# EAGLE design pwr (EAGLE 7.3.0)
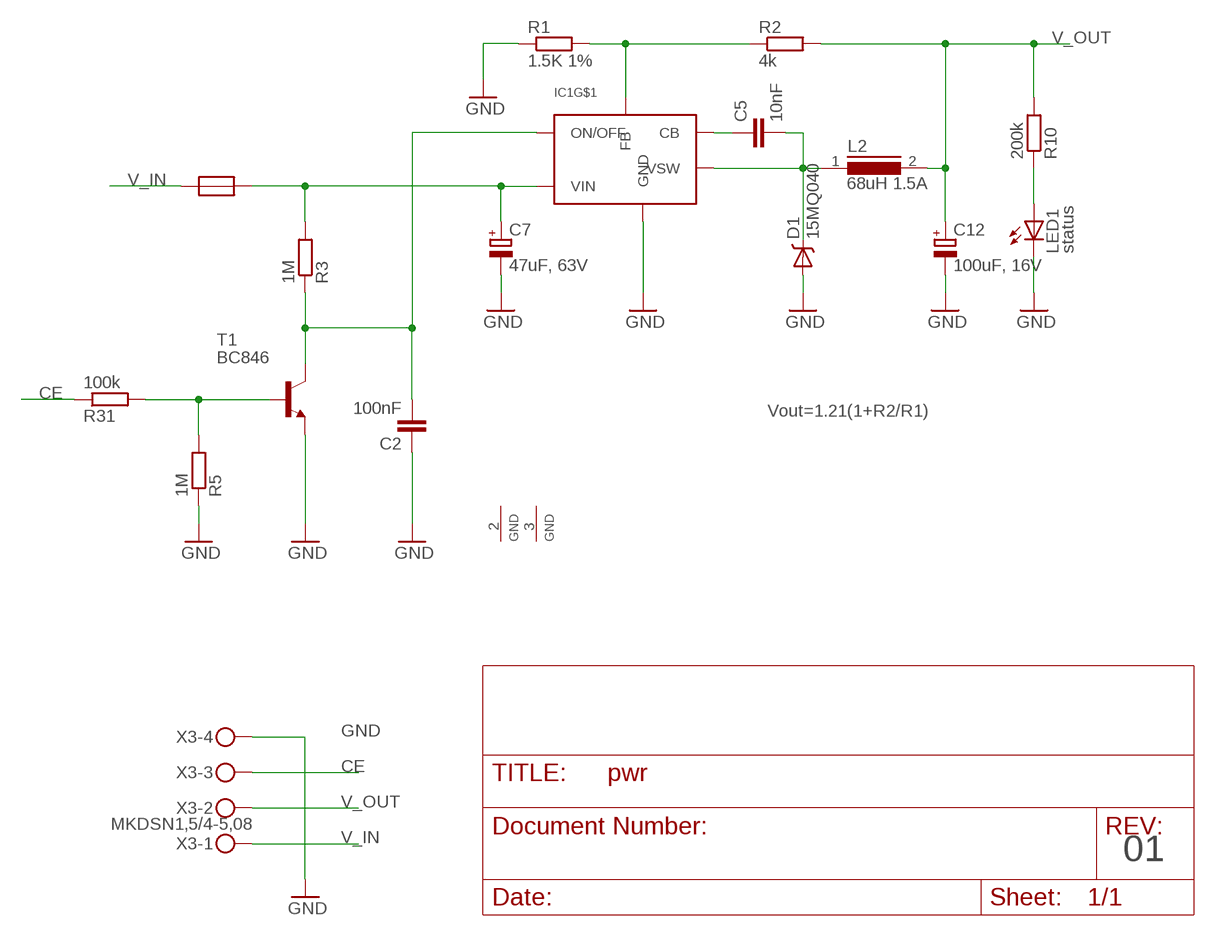
[diagram p0: schematic, sheet 1]

## Parts
C2  100nF  C-EUC0805  [C0805]
C5  10nF  C-EUC0805  [C0805]
C7  47uF, 63V  CPOL-EUF  [PANASONIC_F]
C12  100uF, 16V  CPOL-EUD  [PANASONIC_D]
D1  15MQ040  DIODE-SCHOTTKY-MBRA140  [SMA-DIODE]
IC1  LM2674  [SO-08]
L2  68uH 1.5A  DR125  [DR125]
LED1  status  LEDCHIP-LED0805  [CHIP-LED0805]
R1  1.5K 1%  R-EU_R0805W  [R0805W]
R2  4k  R-EU_R0805W  [R0805W]
R3  1M  R-EU_R0805W  [R0805W]
R5  1M  R-EU_R0805W  [R0805W]
R10  200k  R-EU_R0805W  [R0805W]
R31  100k  R-EU_R0805W  [R0805W]
T1  BC846  [SOT23]
U$1  RESETTABLE_0805  [0805W]
X3  MKDSN1,5/4-5,08  [MKDSN1,5/4-5,08]

## Nets
CE: R31.1 X3.3
GND: C2.1 C7.- C12.- D1.A IC1.6(GND) LED1.C R1.1 R5.1 T1.2(E) X3.4
N$1: LED1.A R10.1
N$2: C2.2 IC1.5(ON/OFF) R3.1 T1.3(C)
N$3: R5.2 R31.2 T1.1(B)
N$4: IC1.4(FB) R1.2 R2.1
N$9: C5.2 D1.C IC1.8(VSW) L2.1
N$10: C5.1 IC1.1(CB)
N$49: C7.+ IC1.7(VIN) R3.2 U$1.2
V_IN: U$1.1 X3.1
V_OUT: C12.+ L2.2 R2.2 R10.2 X3.2

## Notes on the sheet
- Vout=1.21(1+R2/R1)
- 01

## Power pins joined to a net without a drawn wire
GND: IC1.2(GND) IC1.3(GND)

## Library data of the parts
C2 C5 = rcl:C-EU: CAPACITOR, European symbol
C7 C12 = rcl:CPOL-EU: POLARIZED CAPACITOR, European symbol
D1 = SparkFun-DiscreteSemi:DIODE-SCHOTTKY: Schottky diodes in SFE's production catalog BAT20J 1A 23V 0.62Vf RB751 120mA 40V 0.37Vf PMEG4005EJ 0.5A 40V 0.42Vf MBRA140 1A 40V 0.5Vf B340A 3A 40V SMA; PROD_ID: DIO-08053; VALUE: MBRA140
IC1 = Simplex-ICs:LM2674: LM2674 power converter
L2 = inductors:DR125: High Power Density, High Efficiency, Shielded Inductors Source: coiltronics_dr_series.pdf
LED1 = led:LED: LED OSRAM: - CHIPLED LG R971, LG N971, LY N971, LG Q971, LY Q971, LO R971, LY R971 LH N974, LH R974 LS Q976, LO Q976, LY Q976 LO Q996 - Hyper CHIPLED LW Q18S LB Q993, LB Q99A, LB R99A - SideLED LS A670, LO A670, LY A670, LG A670, LP A670 LB A673, LV A673, LT A673, LW A673 LH A674 LY A675 LS A676, LA A676, LO A676, LY A676, LW A676 LS A679, LY A679, LG A679 - Hyper Micro SIDELED® LS Y876, LA Y876, LO Y876, LY Y876 LT Y87S - SmartLED LW L88C, LW L88S LB L89C, LB L89S, LG L890 LS L89K, LO L89K, LY L89K LS L896, LA L896, LO L896, LY L896 - TOPLED LS T670, LO T670, LY T670, LG T670, LP T670 LSG T670, LSP T670, LSY T670, LOP T670, LYG T670 LG T671, LOG T671, LSG T671 LB T673, LV T673, LT T673, LW T673 LH T674 LS T676, LA T676, LO T676, LY T676, LB T676, LH T676, LSB T676, LW T676 LB T67C, LV T67C, LT T67C, LS T67K, LO T67K, LY T67K, LW E67C LS E67B, LA E67B, LO E67B, LY E67B, LB E67C, LV E67C, LT E67C LW T67C LS T679, LY T679, LG T679 LS T770, LO T770, LY T770, LG T770, LP T770 LB T773, LV T773, LT T773, LW T773 LH T774 LS E675, LA E675, LY E675, LS T675 LS T776, LA T776, LO T776, LY T776, LB T776 LHGB T686 LT T68C, LB T68C - Hyper Mini TOPLED® LB M676 - Mini TOPLED Santana® LG M470 LS M47K, LO M47K, LY M47K Source: http://www.osram.convergy.de LUXEON: - LUMILED® LXK2-PW12-R00, LXK2-PW12-S00, LXK2-PW14-U00, LXK2-PW14-V00 LXK2-PM12-R00, LXK2-PM12-S00, LXK2-PM14-U00 LXK2-PE12-Q00, LXK2-PE12-R00, LXK2-PE12-S00, LXK2-PE14-T00, LXK2-PE14-U00 LXK2-PB12-K00, LXK2-PB12-L00, LXK2-PB12-M00, LXK2-PB14-N00, LXK2-PB14-P00, LXK2-PB14-Q00 LXK2-PR12-L00, LXK2-PR12-M00, LXK2-PR14-Q00, LXK2-PR14-R00 LXK2-PD12-Q00, LXK2-PD12-R00, LXK2-PD12-S00 LXK2-PH12-R00, LXK2-PH12-S00 LXK2-PL12-P00, LXK2-PL12-Q00, LXK2-PL12-R00 Source: www.luxeon.com KINGBRIGHT: KA-3528ASYC Source: www.kingbright.com
R1-R3 R5 R10 R31 = rcl:R-EU_: RESISTOR, European symbol
T1 = transistor:BC846: NPN TRANSISTOR
U$1 = Simplex-Fuses:RESETTABLE: resettable fuse
X3 = con-phoenix-508:MKDSN1,5/4-5,08: MKDSN 1,5/ 4-5,08 Printklemme Nennstrom: 13,5 A Nennspannung: 250 V Rastermaß: 5,08 mm Polzahl: 4 Anschlussart: Schraubanschluss Montage: Löten Anschlussrichtung Leiter/Platine: 0 ° Artikelnummer: 1729144 Source: http://eshop.phoenixcontact.com .. 1729144.pdf; MPN: SMKDSN1,5/4-5,08; OC_FARNELL: 1792905; OC_NEWARK: 70R0300

## Net classes
1 vcc: width 0.203 mm

## Board
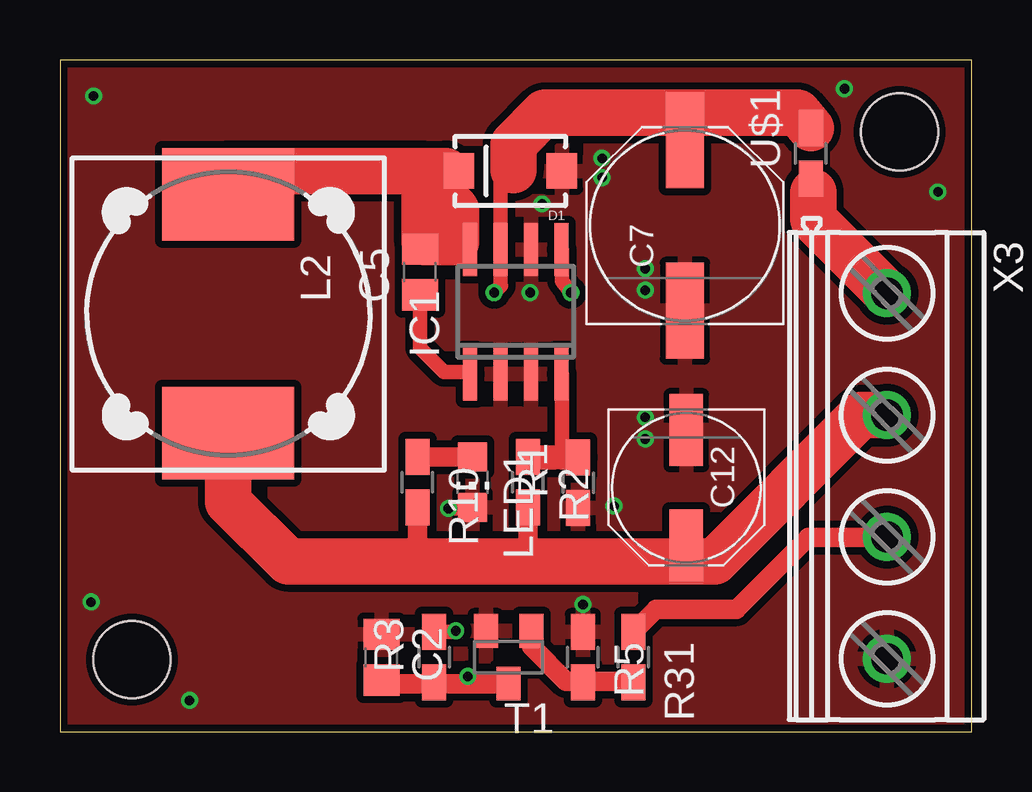
[diagram p1: board, top side]
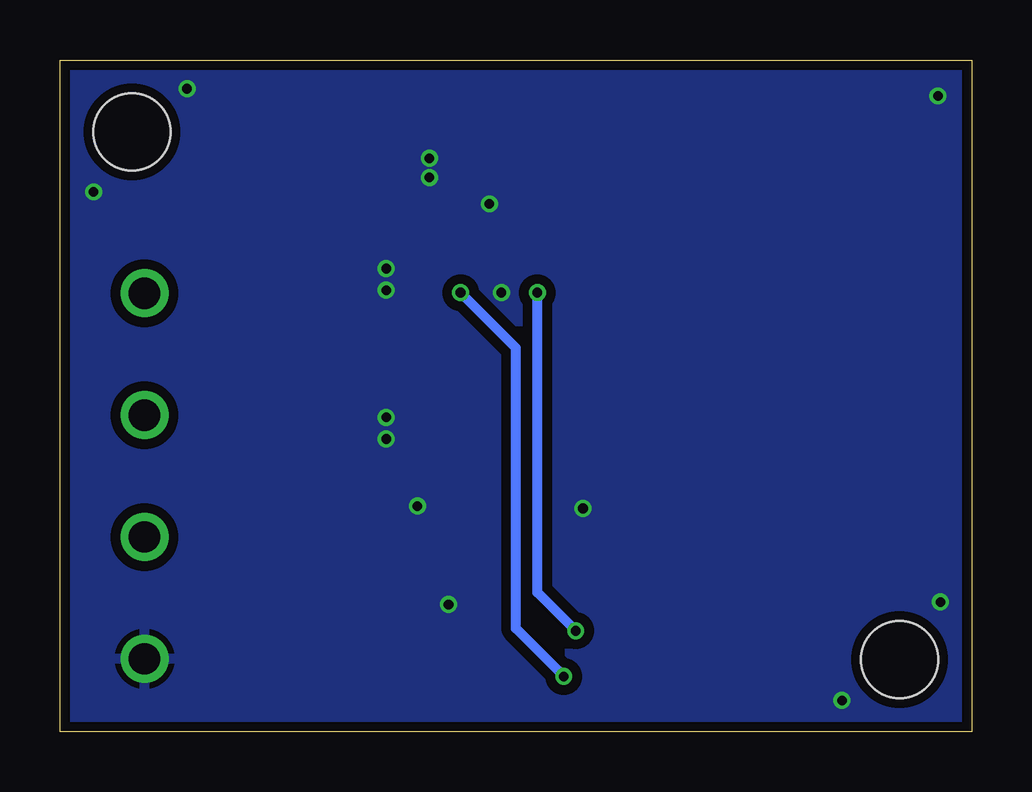
[diagram p2: board, bottom side, seen from below]

Size 38 x 28 mm. Coordinates in mm from the lower left corner, seen from the top.
Outline: 0,0 38,0 38,28 0,28 0,0
Copper layers (1*16): Top 0.035mm / dielectric 1.5mm / Bottom 0.035mm
Design rules "seeed_2-layer_20140221": minimum track width 6mil, minimum drill 12mil, track to track 6mil, track to pad 6mil, pad to pad 6mil, via to via 6mil, smd to smd 0mil, copper to edge 10mil, drill to drill 10mil, minimum pad ring 6mil, minimum via ring 6mil, stop-mask expansion 2mil, vias tented up to drill 100mil, thermal gap 10mil
Holes 3.2 mm at 35,25 3,3

### Footprints (pad centres in the part's own frame; a part is rotated, then mirrored left to right if it is on the bottom)
C0805 = smd 1.3 x 1.5: 1 -0.95,0; 2 0.95,0
PANASONIC_F = smd 4 x 1.6: + 3.55,0; - -3.55,0
PANASONIC_D = smd 3 x 1.4: + 2.4,0; - -2.4,0
SMA-DIODE = smd 1.27 x 1.47: A -2.15,0; C 2.15,0
SO-08 = smd 0.6 x 2.2: 1 -1.905,-2.6; 2 -0.635,-2.6; 3 0.635,-2.6; 4 1.905,-2.6; 5 1.905,2.6; 6 0.635,2.6; 7 -0.635,2.6; 8 -1.905,2.6
DR125 = smd 3.85 x 5.5: 1 -4.975,0; 2 4.975,0
CHIP-LED0805 = smd 1.2 x 1.2: A 0,-1.05; C 0,1.05
R0805W = smd 1.5 x 1: 1 -1.052,0; 2 1.052,0
SOT23 = smd 1 x 1.4: 1 -0.95,-1.1; 2 0.95,-1.1; 3 0,1.1
0805W = smd 1.5 x 1: 1 -1.052,0; 2 1.052,0
MKDSN1,5/4-5,08 = drill 1.3 pad 2: 1 -7.641,0.025; 2 -2.561,0.025; 3 2.519,0.025; 4 7.599,0.025

### Placement (x,y rotation side)
C2  13.4,3.1 270 top
C5  15,19.16 90 top
C7  26.05,21.1 90 top
C12  26.11,10.17 270 top
D1  18.77,23.37 180 top
IC1  19,17.5 0 top
L2  7.02,17.42 270 top
LED1  17.2,10.4 180 top
R1  21.6,10.38 90 top
R2  19.5,10.4 270 top
R3  15.6,3.1 90 top
R5  21.8,3.1 270 top
R10  14.9,10.4 270 top
R31  23.9,3.1 270 top
T1  18.7,3.1 180 top
U$1  31.3,24.1 90 top
X3  34.45,10.63 270 top

### Tracks (layer width: path | path; a pad name or v marks a point on that pad's centre or on a via)
CE
  Top 0.813: R31.1 24.85,5.1 28.2,5.1 31.2,8.1 34.46,8.1 X3.3
GND  (via drill 0.4)
  Top 0.61: LED1.C 17.15,9.3 v16.2,9.3
  other vias: 21.8,5.3 22.6,23.9 20.1,22 24.4,19.3 24.4,18.4 24.4,13.1 24.4,12.2 19.6,18.3 22.6,23.1 23.1,9.4 1.4,26.5 1.3,5.4 5.4,1.3 32.7,26.8 36.6,22.5
  pour Top (isolate 0.305): 0,28 0,0 38,0 38,28
  pour Bottom (isolate 0.406): 0,28 0,0 38,0 38,28
N$1
  Top 0.813: R10.1 LED1.A
N$2  (via drill 0.4)
  Top 0.406: R3.1 16.75,2.05 v17,2.3
  Top 0.61: v21.3,18.3 20.93,18.77 20.93,20.08 IC1.5
  Top 0.813: T1.3 15.6,2 | 15.6,2 13.55,2 C2.2 | R3.1 15.6,2
  Bottom 0.406: v17,2.3 19,4.3 19,16 v21.3,18.3
N$3
  Top 0.813: T1.1 19.65,3.55 21.1,2.1 21.5,2.1 | 21.5,2.1 23.85,2.1 R31.2 | R5.2 21.55,2.05 21.5,2.1
N$4
  Top 0.61: IC1.4 20.93,14.88 20.93,11.43
  Top 0.813: R2.1 19.52,11.43 | 20.6,11.43 20.93,11.43
  Top 1.016: 19.52,11.43 20.6,11.43 | 20.93,11.43 R1.2
N$9
  Top 0.406: IC1.8 16.5,20.1 16.5,20.4 | C5.2 15.2,20.11 15.2,20.4
  Top 0.61: D1.C 16.1,23.37
  Top 0.813: 15,23.27 15.1,23.37
  Top 1.93: L2.1 7.02,23.37 15.1,23.37 16.1,23.37 16.1,23.3 | 15,23.27 16.5,21.77 16.5,20.4 15.2,20.4 15.2,22.9
N$10
  Top 0.61: C5.1 15,16 16.02,14.98 17.02,14.98 IC1.1
N$49  (via drill 0.4)
  Top 0.406: 16.45,4.15 v16.5,4.2
  Top 0.61: R3.2 16.45,4.15 | 18.39,18.59 v18.1,18.3 18.36,18.57 IC1.7 18.36,22.86 18.9,23.4
  Top 0.813: 18.39,23.6 18.9,23.6 | C7.+ 26.05,25.65 25.9,25.8
  Top 1.93: 18.9,23.4 18.9,23.6 18.9,24.5 20.2,25.8 25.9,25.8 30.75,25.8 U$1.2
  Bottom 0.406: v16.5,4.2 18.1,5.8 v18.1,18.3
V_IN
  Top 0.406: 31.4,22.5 U$1.1
  Top 1.93: X3.1 31.4,21.35 31.4,22.5
V_OUT
  Top 0.813: C12.+ arc-90 26.2,7.68 26.3,7.58 26.3,7.1 | R10.2 14.9,7.1 14.7,7.1 | R2.2 19.5,7.1 19.7,7.1
  Top 1.93: L2.2 7.02,9.58 9.5,7.1 14.7,7.1 19.7,7.1 26.3,7.1 27.3,7.1 33.39,13.19 X3.2

### Text on the board
tmine: V_IN = 6.5 - 40V / V_OUT = 1.21(1+R2/R1) | R2 | R1 | V_IN / V_OUT / CE / GND